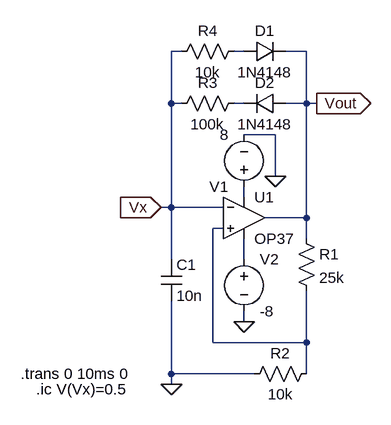
[diagram p0: schematic Fig7.asc]
Fig7.asc, the LTspice schematic file:
Version 4
SHEET 1 880 680
WIRE 128 -96 112 -96
WIRE 224 -96 208 -96
WIRE 320 -96 288 -96
WIRE 112 -16 112 -96
WIRE 128 -16 112 -16
WIRE 224 -16 208 -16
WIRE 320 -16 320 -96
WIRE 320 -16 288 -16
WIRE 336 -16 320 -16
WIRE 272 32 224 32
WIRE 272 96 272 32
WIRE 224 128 224 112
WIRE 112 144 112 -16
WIRE 112 144 96 144
WIRE 192 144 112 144
WIRE 320 160 320 -16
WIRE 320 160 256 160
WIRE 192 176 176 176
WIRE 320 192 320 160
WIRE 112 224 112 144
WIRE 224 224 224 192
WIRE 224 320 224 304
WIRE 176 352 176 176
WIRE 320 352 320 272
WIRE 320 352 176 352
WIRE 112 400 112 288
WIRE 240 400 112 400
WIRE 320 400 320 352
WIRE 112 416 112 400
FLAG 272 96 0
FLAG 224 320 0
FLAG 112 416 0
FLAG 96 144 Vx
IOPIN 96 144 In
FLAG 336 -16 Vout
IOPIN 336 -16 Out
SYMBOL Opamps\\OP37 224 96 R0
SYMATTR InstName U1
SYMBOL voltage 224 128 R180
WINDOW 123 0 0 Left 0
WINDOW 39 0 0 Left 0
SYMATTR InstName V1
SYMATTR Value 8
SYMBOL voltage 224 208 R0
WINDOW 123 0 0 Left 0
WINDOW 39 0 0 Left 0
SYMATTR InstName V2
SYMATTR Value -8
SYMBOL res 304 176 R0
SYMATTR InstName R1
SYMATTR Value 25k
SYMBOL res 336 384 R90
WINDOW 0 0 56 VBottom 2
WINDOW 3 32 56 VTop 2
SYMATTR InstName R2
SYMATTR Value 10k
SYMBOL diode 224 -80 R270
WINDOW 0 32 32 VTop 2
WINDOW 3 0 32 VBottom 2
SYMATTR InstName D1
SYMATTR Value 1N4148
SYMBOL diode 288 -32 R90
WINDOW 0 0 32 VBottom 2
WINDOW 3 32 32 VTop 2
SYMATTR InstName D2
SYMATTR Value 1N4148
SYMBOL res 224 -32 R90
WINDOW 0 0 56 VBottom 2
WINDOW 3 32 56 VTop 2
SYMATTR InstName R3
SYMATTR Value 100k
SYMBOL res 224 -112 R90
WINDOW 0 0 56 VBottom 2
WINDOW 3 32 56 VTop 2
SYMATTR InstName R4
SYMATTR Value 10k
SYMBOL cap 96 224 R0
SYMATTR InstName C1
SYMATTR Value 10n
TEXT -96 424 Left 2 !.ic V(Vx)=0.5
TEXT -120 400 Left 2 !.trans 0 10ms 0

The netlist it stands for:
* Fig7.asc
XU1 N004 Vx N003 N005 Vout LT1037  ; OP37, pins In+ In- V+ V- OUT
V1 N003 0 8
V2 N005 0 -8
R1 Vout N004 25k
R2 N004 0 10k
D1 N001 Vout 1N4148
D2 Vout N002 1N4148
R3 N002 Vx 100k
R4 N001 Vx 10k
C1 Vx 0 10n
.model D D
.lib standard.dio
.ic V(Vx)=0.5
.trans 0 10ms 0
.lib LTC.lib
.backanno
.end